# Altium schematic sheet DS90LV004TVS.schdoc
size 127 x 99 mm
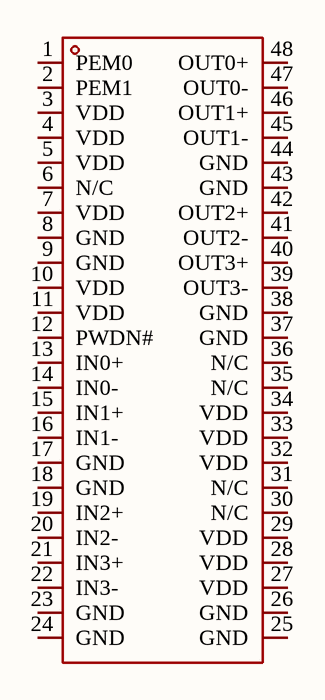
[diagram p0: DS90LV004TVS.schdoc]

## Parts
U?  DS90LV004TVS/NOPB  [TQFP-48_L7.0-W7.0-P0.50-LS9.0-BL]  (value not drawn)

## Nets

Not connected (* = marked no-connect by the designer): U? 1(PEM0) 2(PEM1) 3(VDD) 4(VDD) 5(VDD) 6(N/C) 7(VDD) 8(GND) 9(GND) 10(VDD) 11(VDD) 12(PWDN#) 13(IN0+) 14(IN0-) 15(IN1+) 16(IN1-) 17(GND) 18(GND) 19(IN2+) 20(IN2-) 21(IN3+) 22(IN3-) 23(GND) 24(GND) 25(GND) 26(GND) 27(VDD) 28(VDD) 29(VDD) 30(N/C) 31(N/C) 32(VDD) 33(VDD) 34(VDD) 35(N/C) 36(N/C) 37(GND) 38(GND) 39(OUT3-) 40(OUT3+) 41(OUT2-) 42(OUT2+) 43(GND) 44(GND) 45(OUT1-) 46(OUT1+) 47(OUT0-) 48(OUT0+)

## Library data of the parts
U? = DS90LV004TVS/NOPB: Manufacturer: TI(德州仪器); Add into BOM: yes; Protocol: LVDS; Numberof Drivers: 4; Supply Voltage: 3.15V~3.45V; Data Rate: 1.5Gbps; Symbol: DS90LV004TVS/NOPB; Device: DS90LV004TVS/NOPB; LCSC Part Name: DS90LV004 4通道LVDS缓冲器/中继器带预加重功能; Supplier Part: C1522660; Manufacturer Part: DS90LV004TVS/NOPB; Supplier Footprint: TQFP-48(7x7); JLCPCB Part Class: Extended Part; Datasheet: https://www.ti.com/cn/lit/gpn/ds90lv004; Supplier: LCSC; Convert to PCB: yes; Type: 中继器；缓冲器; Numberof Receivers: 4; Operating Temperature: -40℃~+85℃